# Altium schematic sheet CONTROLE_MOTEUR_PLEIADES.SchDoc
size Tabloid; SheetNumber: 4; SheetTotal: 5; Sheet_Name: Insert name in Document Parameters; Size: 11x17
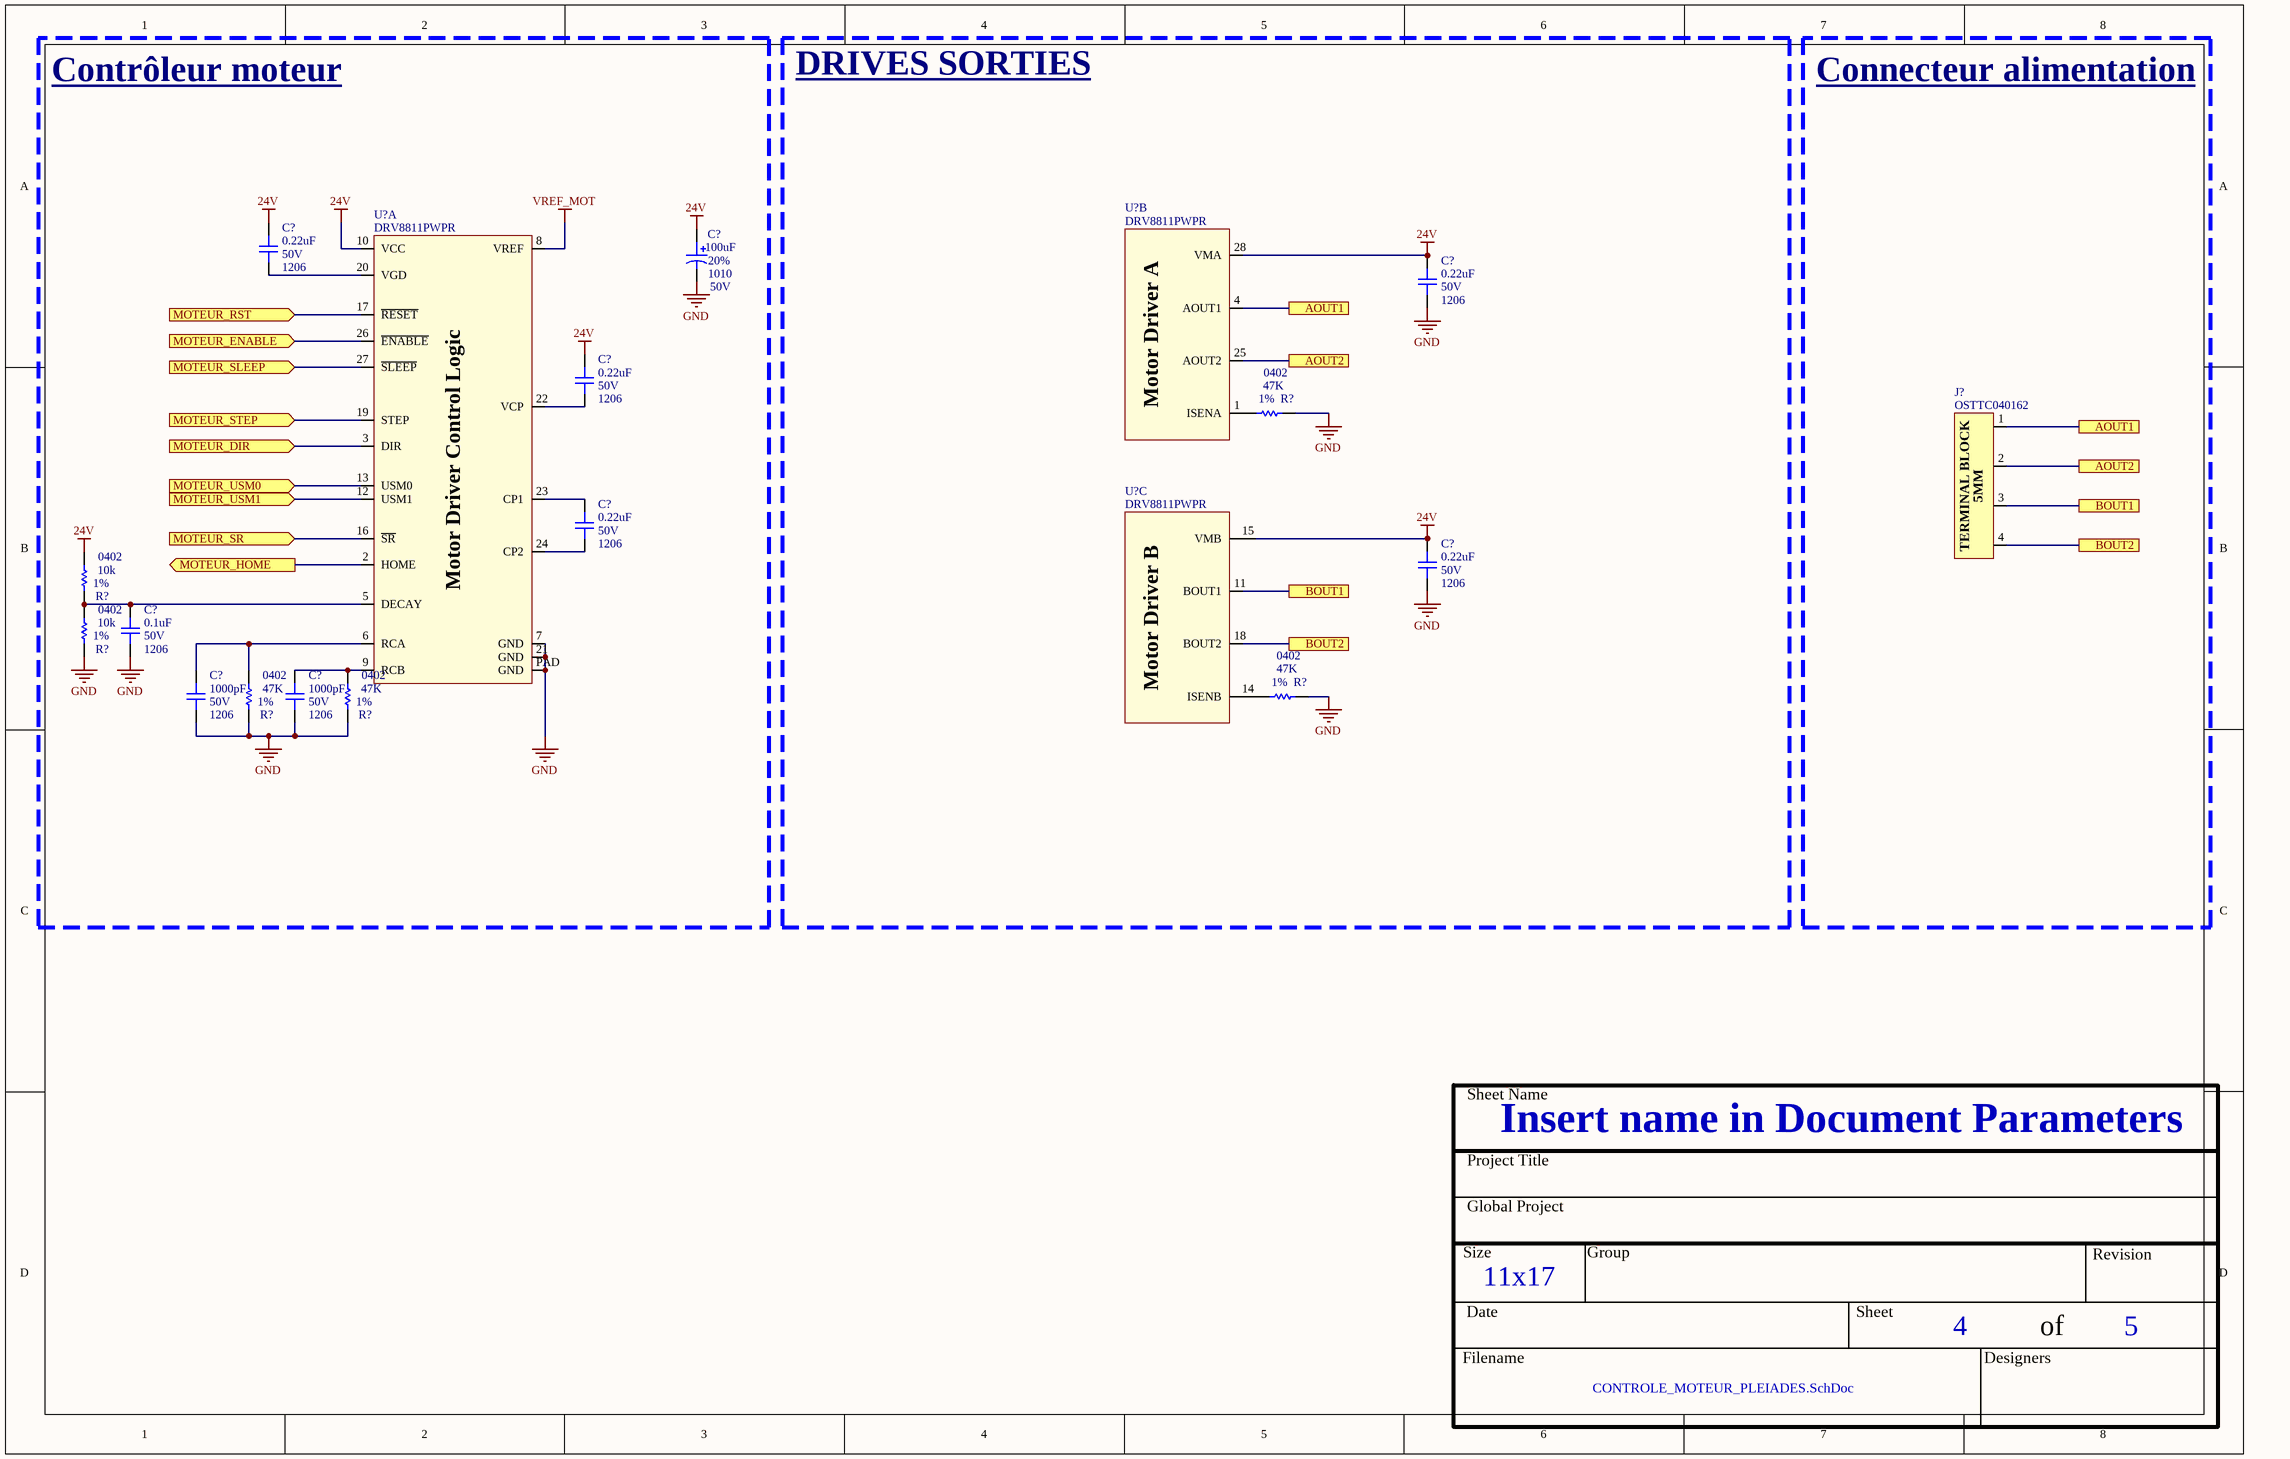
[diagram p0: CONTROLE_MOTEUR_PLEIADES.SchDoc]

## Parts
(Parts that share a designator on the sheet are numbered #1, #2 ... from top to bottom, then left to right.)
C?#1  value 0.22uF  Voltage: 50V  Package: 1206  [CAP_1206]  (hidden comment: CAP - 1206)
C?#2  value 100uF  Voltage: 50V  Package: 1010  Precision: 20%  [CAP_ALU_1010_vishay]  (hidden comment: MAL215099101E3)
C?#3  value 0.22uF  Voltage: 50V  Package: 1206  [CAP_1206]  (hidden comment: CAP - 1206)
C?#4  value 0.22uF  Voltage: 50V  Package: 1206  [CAP_1206]  (hidden comment: CAP - 1206)
C?#5  value 0.22uF  Voltage: 50V  Package: 1206  [CAP_1206]  (hidden comment: CAP - 1206)
C?#6  value 0.22uF  Voltage: 50V  Package: 1206  [CAP_1206]  (hidden comment: CAP - 1206)
C?#7  value 0.1uF  Voltage: 50V  Package: 1206  [CAP_1206]  (hidden comment: CAP - 1206)
C?#8  value 1000pF  Voltage: 50V  Package: 1206  [CAP_1206]  (hidden comment: CAP - 1206)
C?#9  value 1000pF  Voltage: 50V  Package: 1206  [CAP_1206]  (hidden comment: CAP - 1206)
J?  OSTTC040162  [CONN_TERMINAL_OSTTA040161]
R?#1  value 47K  Package: 0402  Precision: 1%  [RES_0402]  (hidden comment: RES - 0402)
R?#2  value 10k  Package: 0402  Precision: 1%  [RES_0402]  (hidden comment: RES - 0402)
R?#3  value 10k  Package: 0402  Precision: 1%  [RES_0402]  (hidden comment: RES - 0402)
R?#4  value 47K  Package: 0402  Precision: 1%  [RES_0402]  (hidden comment: RES - 0402)
R?#5  value 47K  Package: 0402  Precision: 1%  [RES_0402]  (hidden comment: RES - 0402)
R?#6  value 47K  Package: 0402  Precision: 1%  [RES_0402]  (hidden comment: RES - 0402)
U?#1  DRV8811PWPR  [POW_MOTOR_DRV8811PWPR]  (part B of 3)
U?#2  DRV8811PWPR  [POW_MOTOR_DRV8811PWPR]  (part A of 3)
U?#3  DRV8811PWPR  [POW_MOTOR_DRV8811PWPR]  (part C of 3)

## Blocks framed on the sheet
Contrôleur moteur: C?#1 C?#2 C?#4 C?#5 C?#7-C?#9 R?#2-R?#5 U?#2
DRIVES SORTIES: C?#3 C?#6 R?#1 R?#6 U?#1 U?#3
Connecteur alimentation: J?

## Ports
AOUT1, AOUT2, BOUT1, BOUT2, MOTEUR_DIR (in), MOTEUR_ENABLE (in), MOTEUR_HOME (out), MOTEUR_RST (in), MOTEUR_SLEEP (in), MOTEUR_SR (in), MOTEUR_STEP (in), MOTEUR_USM0 (in), MOTEUR_USM1 (in)

## Nets
24V: C?#1.2 C?#2.1 C?#3.2 C?#4.2 C?#6.2 R?#2.1 U?#1.28(VMA) U?#2.10(VCC) U?#3.15(VMB)
GND: C?#2.2 C?#3.1 C?#6.1 C?#7.1 C?#8.1 C?#9.1 R?#1.2 R?#3.2 R?#4.2 R?#5.2 R?#6.2 U?#2.7(GND) U?#2.21(GND) U?#2.PAD(GND)
VREF_MOT: U?#2.8(VREF)
AOUT1: J?.1 U?#1.4(AOUT1) ; port AOUT1
AOUT2: J?.2 U?#1.25(AOUT2) ; port AOUT2
BOUT1: J?.3 U?#3.11(BOUT1) ; port BOUT1
BOUT2: J?.4 U?#3.18(BOUT2) ; port BOUT2
MOTEUR_DIR: U?#2.3(DIR) ; port MOTEUR_DIR
MOTEUR_ENABLE: U?#2.26(~{ENABLE}) ; port MOTEUR_ENABLE
MOTEUR_HOME: U?#2.2(HOME) ; port MOTEUR_HOME
MOTEUR_RST: U?#2.17(~{RESET}) ; port MOTEUR_RST
MOTEUR_SLEEP: U?#2.27(~{SLEEP}) ; port MOTEUR_SLEEP
MOTEUR_SR: U?#2.16(~{SR}) ; port MOTEUR_SR
MOTEUR_STEP: U?#2.19(STEP) ; port MOTEUR_STEP
MOTEUR_USM0: U?#2.13(USM0) ; port MOTEUR_USM0
MOTEUR_USM1: U?#2.12(USM1) ; port MOTEUR_USM1
NetC?#1_1: C?#1.1 U?#2.20(VGD)
NetC?#4_1: C?#4.1 U?#2.22(VCP)
NetC?#5_1: C?#5.1 U?#2.24(CP2)
NetC?#5_2: C?#5.2 U?#2.23(CP1)
NetC?#7_2: C?#7.2 R?#2.2 R?#3.1 U?#2.5(DECAY)
NetC?#8_2: C?#8.2 R?#4.1 U?#2.6(RCA)
NetC?#9_2: C?#9.2 R?#5.1 U?#2.9(RCB)
NetR?#1_1: R?#1.1 U?#1.1(ISENA)
NetR?#6_1: R?#6.1 U?#3.14(ISENB)

## Notes on the sheet
- Sheet Name
- Project Title
- Global Project
- Size
- Group
- Revision
- Date
- Sheet
- of
- Filename
- Designers
- (in symbol CONN_TERMINAL_OSTTC040162) TERMINAL BLOCK; 5MM
- (in symbol POW_MOTOR_DRV8811PWPR, part A) Motor Driver Control Logic
- (in symbol POW_MOTOR_DRV8811PWPR, part B) Motor Driver A
- (in symbol POW_MOTOR_DRV8811PWPR, part C) Motor Driver B

## Library data of the parts
C?#1 C?#3-C?#9 = CAP - 1206: Precision: 10%; Current: *; CreatedBy: Jonathan Bouchard; Power: *
C?#2 = CAP_ALU_MAL215099101E3: CAP - ALU 100uF 20% 50V - 1010; Current: 490mA; Mfg: Vishay Dale; Mfg Part Number: MAL215099101E3; HelpURL: http://www.vishay.com/docs/28395/150crz.pdf; CreatedBy: Jonathan Bouchard; Temperature: -55°C to 125°C; Power: *; Supplier 1: Digikey; Supplier Part Number 1: 4399PHDKR-ND
J? = CONN_TERMINAL_OSTTC040162: CONN -  TERMINAL BLOCK 4POS 5MM - TH; Mfg: On Shore Technology Inc.; Voltage: *; Current: *; Power: *; Mfg Part Number: OSTTC040162; HelpURL: http://www.on-shore.com/wp-content/uploads/2015/09/osttcxx0162.pdf; CreatedBy: Jonathan Bouchard; Temperature: -30°C ~ 105°C; Value: *; Precision: *; Package: TH-4; Supplier 1: Digikey; Supplier Part Number 1: ED2602-ND
R?#1-R?#6 = RES - 0402: Voltage: 50V; Power: 1/16W; Current: *; CreatedBy: Jonathan Bouchard
U?#1-U?#3 = POW_MOTOR_DRV8811PWPR: POW - STEPPER MOTOR DRIVER - SOP-28; Voltage: 3 V ~ 5.5 V / 8 V ~ 38 V; Mfg: Texas Instrument; Current: *; Power: *; Mfg Part Number: DRV8811PWPR; HelpURL: http://www.ti.com/lit/ds/symlink/drv8811.pdf; CreatedBy: Jonathan Bouchard; Temperature: -40°C ~ 150°C (TJ); Value: *; Precision: *; Package: SOP-28; Supplier 1: Digikey; Supplier Part Number 1: 296-24591-1-ND